# Altium schematic sheet Блок1.SchDoc
size A4; DocumentNumber: 2; SheetNumber: 2; SheetTotal: 12
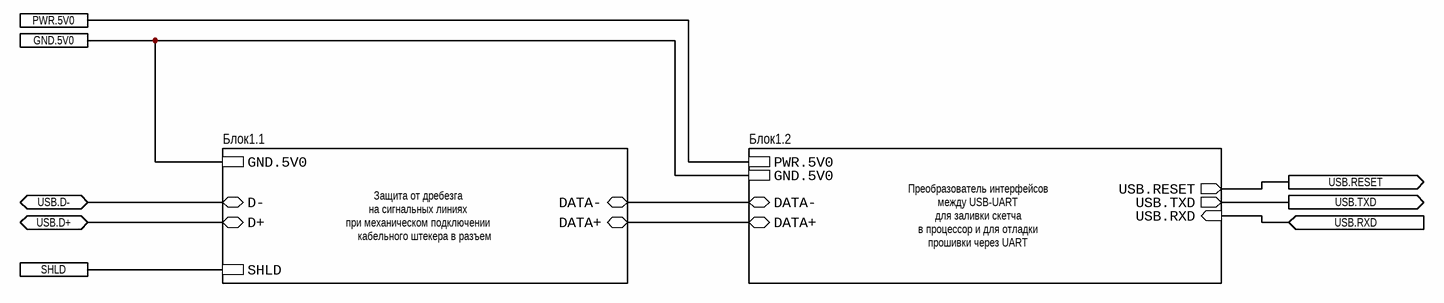
[diagram p0: Блок1.SchDoc]

## Sub-sheets
Блок1.1 = Блок1.1.SchDoc: DATA+ (bidir), GND.5V0, DATA- (bidir), D- (bidir), D+ (bidir), SHLD  | Parameter 1: Защита от дребезга; Parameter 2: на сигнальных линиях; Parameter 3: при механическом подключении; Parameter 4: кабельного штекера в разъем
Блок1.2 = Блок1.2.SchDoc: USB.TXD (out), DATA- (bidir), DATA+ (bidir), USB.RXD (in), USB.RESET (out), PWR.5V0, GND.5V0  | Parameter 1: между USB-UART; Parameter 2: для заливки скетча; Parameter 3: в процессор и для отладки; Parameter 4: Преобразователь интерфейсов; Parameter 5: прошивки через UART

## Ports
GND.5V0, PWR.5V0, SHLD, USB.D+ (bidir), USB.D- (bidir), USB.RESET (out), USB.RXD (in), USB.TXD (out)

## Nets
GND.5V0: port GND.5V0, sheet Блок1.2/GND.5V0, sheet Блок1.1/GND.5V0
PWR.5V0: port PWR.5V0, sheet Блок1.2/PWR.5V0
SHLD: port SHLD, sheet Блок1.1/SHLD
USB.D+: port USB.D+, sheet Блок1.1/D+
USB.D-: port USB.D-, sheet Блок1.1/D-
USB.RESET: port USB.RESET, sheet Блок1.2/USB.RESET
USB.RXD: port USB.RXD, sheet Блок1.2/USB.RXD
USB.TXD: port USB.TXD, sheet Блок1.2/USB.TXD
(unnamed): sheet Блок1.2/DATA-, sheet Блок1.1/DATA-
(unnamed): sheet Блок1.2/DATA+, sheet Блок1.1/DATA+